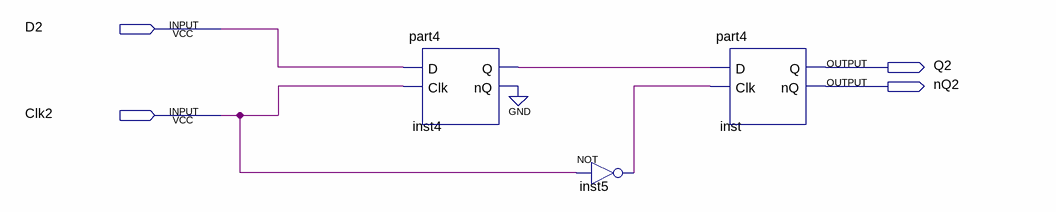
[diagram p0: schematic sheet]
// Quartus schematic fpcd.bdf as structural Verilog: 3 symbols, 4 pins
module fpcd (
  input  D2,
  input  Clk2,
  output Q2,
  output nQ2
);

  wire inst4_nq, inst4_q, inst5_out;

  part4 inst4 (.D(D2), .Clk(Clk2), .Q(inst4_q), .nQ(inst4_nq));
  not inst5 (inst5_out, Clk2);
  part4 inst (.D(inst4_q), .Clk(inst5_out), .Q(Q2), .nQ(nQ2));
  // also tied to GND on the sheet: inst4_nq
endmodule
